# Altium schematic sheet [07] - Sensors.SchDoc
size A4
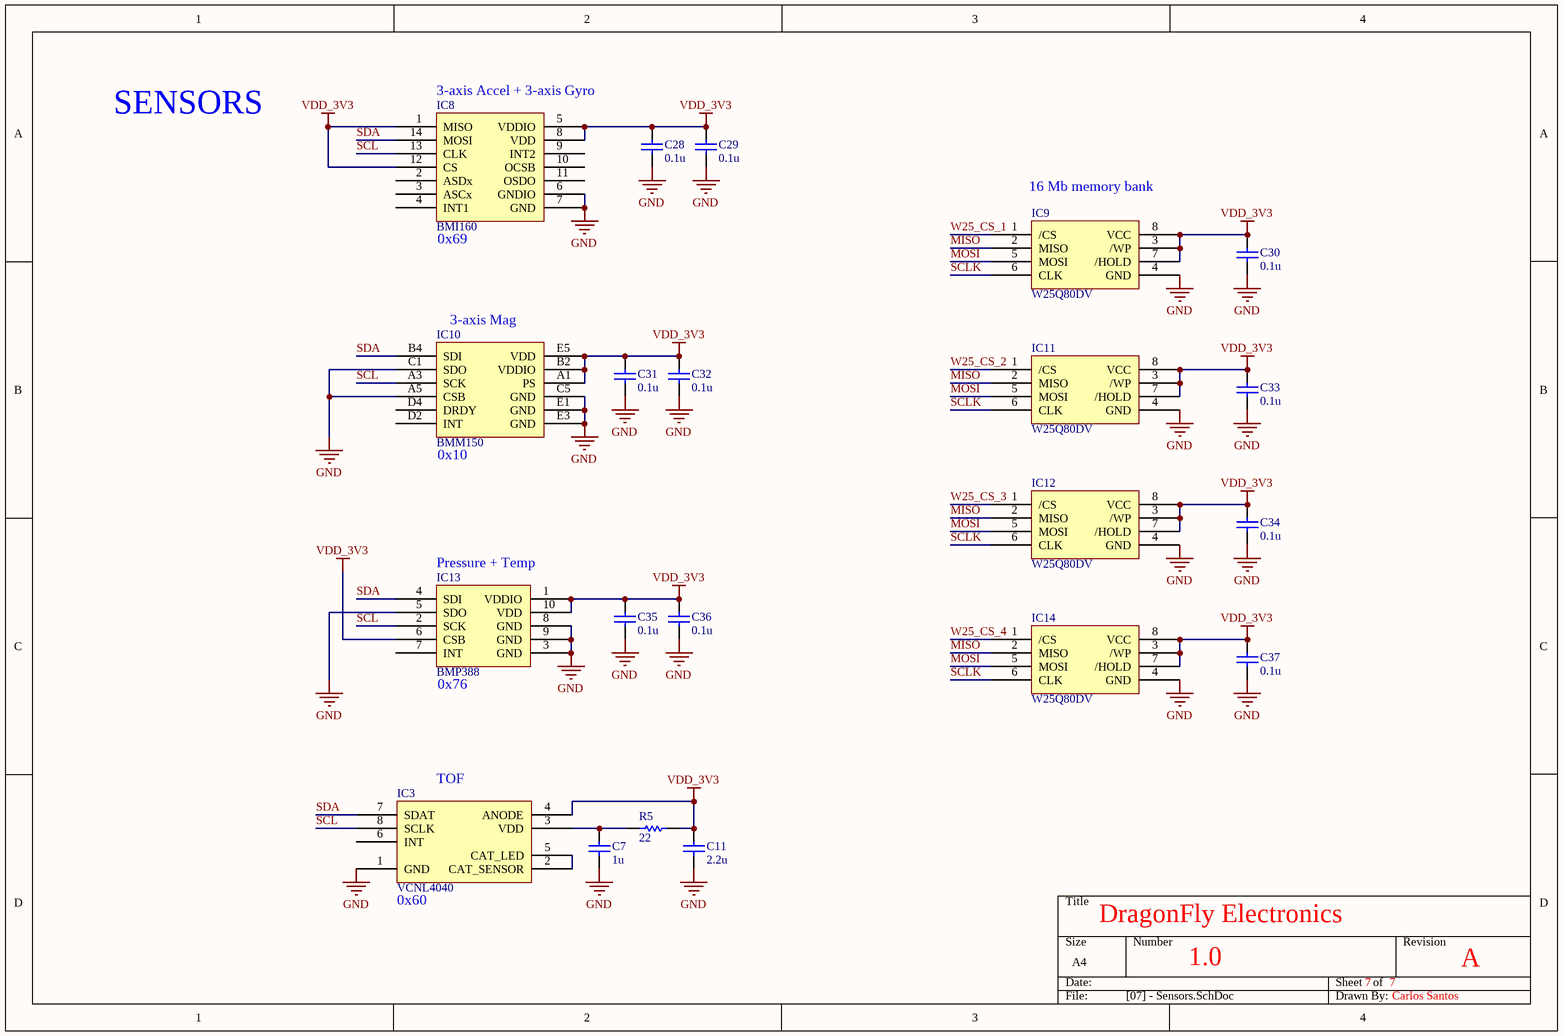
[diagram p0: [07] - Sensors.SchDoc]

## Parts
C7  value 1u  [0402 - Capacitor]  (hidden comment: Capacitor)
C11  value 2.2u  [0402 - Capacitor]  (hidden comment: Capacitor)
C28  value 0.1u  [0402 - Capacitor]  (hidden comment: Capacitor)
C29  value 0.1u  [0402 - Capacitor]  (hidden comment: Capacitor)
C30  value 0.1u  [0402 - Capacitor]  (hidden comment: Capacitor)
C31  value 0.1u  [0402 - Capacitor]  (hidden comment: Capacitor)
C32  value 0.1u  [0402 - Capacitor]  (hidden comment: Capacitor)
C33  value 0.1u  [0402 - Capacitor]  (hidden comment: Capacitor)
C34  value 0.1u  [0402 - Capacitor]  (hidden comment: Capacitor)
C35  value 0.1u  [0402 - Capacitor]  (hidden comment: Capacitor)
C36  value 0.1u  [0402 - Capacitor]  (hidden comment: Capacitor)
C37  value 0.1u  [0402 - Capacitor]  (hidden comment: Capacitor)
IC3  VCNL4040  [VCNL4040M3OE]
IC8  BMI160  [BMI160]
IC9  W25Q80DV  [8 - Pad USON 2x3mm]
IC10  BMM150  [BMM150]
IC11  W25Q80DV  [8 - Pad USON 2x3mm]
IC12  W25Q80DV  [8 - Pad USON 2x3mm]
IC13  BMP388  [BMP388]
IC14  W25Q80DV  [8 - Pad USON 2x3mm]
R5  value 22  [0402 - Resistor]  (hidden comment: Resistor)

## Nets
GND: C7.1 C11.1 C28.1 C29.1 C30.1 C31.1 C32.1 C33.1 C34.1 C35.1 C36.1 C37.1 IC3.1(GND) IC8.6(GNDIO) IC8.7(GND) IC9.4(GND) IC10.A5(CSB) IC10.C1(SDO) IC10.C5(GND) IC10.E1(GND) IC10.E3(GND) IC11.4(GND) IC12.4(GND) IC13.3(GND) IC13.5(SDO) IC13.8(GND) IC13.9(GND) IC14.4(GND)
VDD_3V3: C11.2 C28.2 C29.2 C30.2 C31.2 C32.2 C33.2 C34.2 C35.2 C36.2 C37.2 IC3.4(ANODE) IC8.1(MISO) IC8.5(VDDIO) IC8.8(VDD) IC8.12(CS) IC9.3(/WP) IC9.7(/HOLD) IC9.8(VCC) IC10.A1(PS) IC10.B2(VDDIO) IC10.E5(VDD) IC11.3(/WP) IC11.7(/HOLD) IC11.8(VCC) IC12.3(/WP) IC12.7(/HOLD) IC12.8(VCC) IC13.1(VDDIO) IC13.6(CSB) IC13.10(VDD) IC14.3(/WP) IC14.7(/HOLD) IC14.8(VCC) R5.2
MISO: IC9.2(MISO) IC11.2(MISO) IC12.2(MISO) IC14.2(MISO)
MOSI: IC9.5(MOSI) IC11.5(MOSI) IC12.5(MOSI) IC14.5(MOSI)
SCL: IC3.8(SCLK) IC8.13(CLK) IC10.A3(SCK) IC13.2(SCK)
SCLK: IC9.6(CLK) IC11.6(CLK) IC12.6(CLK) IC14.6(CLK)
SDA: IC3.7(SDAT) IC8.14(MOSI) IC10.B4(SDI) IC13.4(SDI)
W25_CS_1: IC9.1(/CS)
W25_CS_2: IC11.1(/CS)
W25_CS_3: IC12.1(/CS)
W25_CS_4: IC14.1(/CS)
NetC7_2: C7.2 IC3.3(VDD) R5.1
NetIC3_2: IC3.2(CAT_SENSOR) IC3.5(CAT_LED)

Not connected (* = marked no-connect by the designer): IC3 6(INT); IC8 2(ASDx) 3(ASCx) 4(INT1) 9(INT2) 10(OCSB) 11(OSDO); IC10 D2(INT) D4(DRDY); IC13 7(INT)

## Notes on the sheet
- (near IC8) 3-axis Accel + 3-axis Gyro
- SENSORS
- (near IC8) 0x69
- (near IC9) 16 Mb memory bank
- (near IC10) 3-axis Mag
- (near IC10) 0x10
- (near IC13) Pressure + Temp
- (near IC13) 0x76
- (near IC3) TOF
- (near IC3) 0x60
- DragonFly Electronics
- 1.0
- 7
- A
- Carlos Santos

## Library data of the parts
IC9 IC11 IC12 IC14 = W25X20CL: DigiKey Part #: W25Q80DVUXIECT-ND
IC3 = VCNL4040: DigiKey Part #: VCNL4040M3OECT-ND
IC8 = BMI160: DigiKey Part #: 828-1057-1-ND
IC10 = BMM150: DigiKey Part #: 828-1044-1-ND
IC13 = BMP388: DigiKey Part #: 828-1079-1-ND